# EAGLE design v4.01 (EAGLE 6.2)
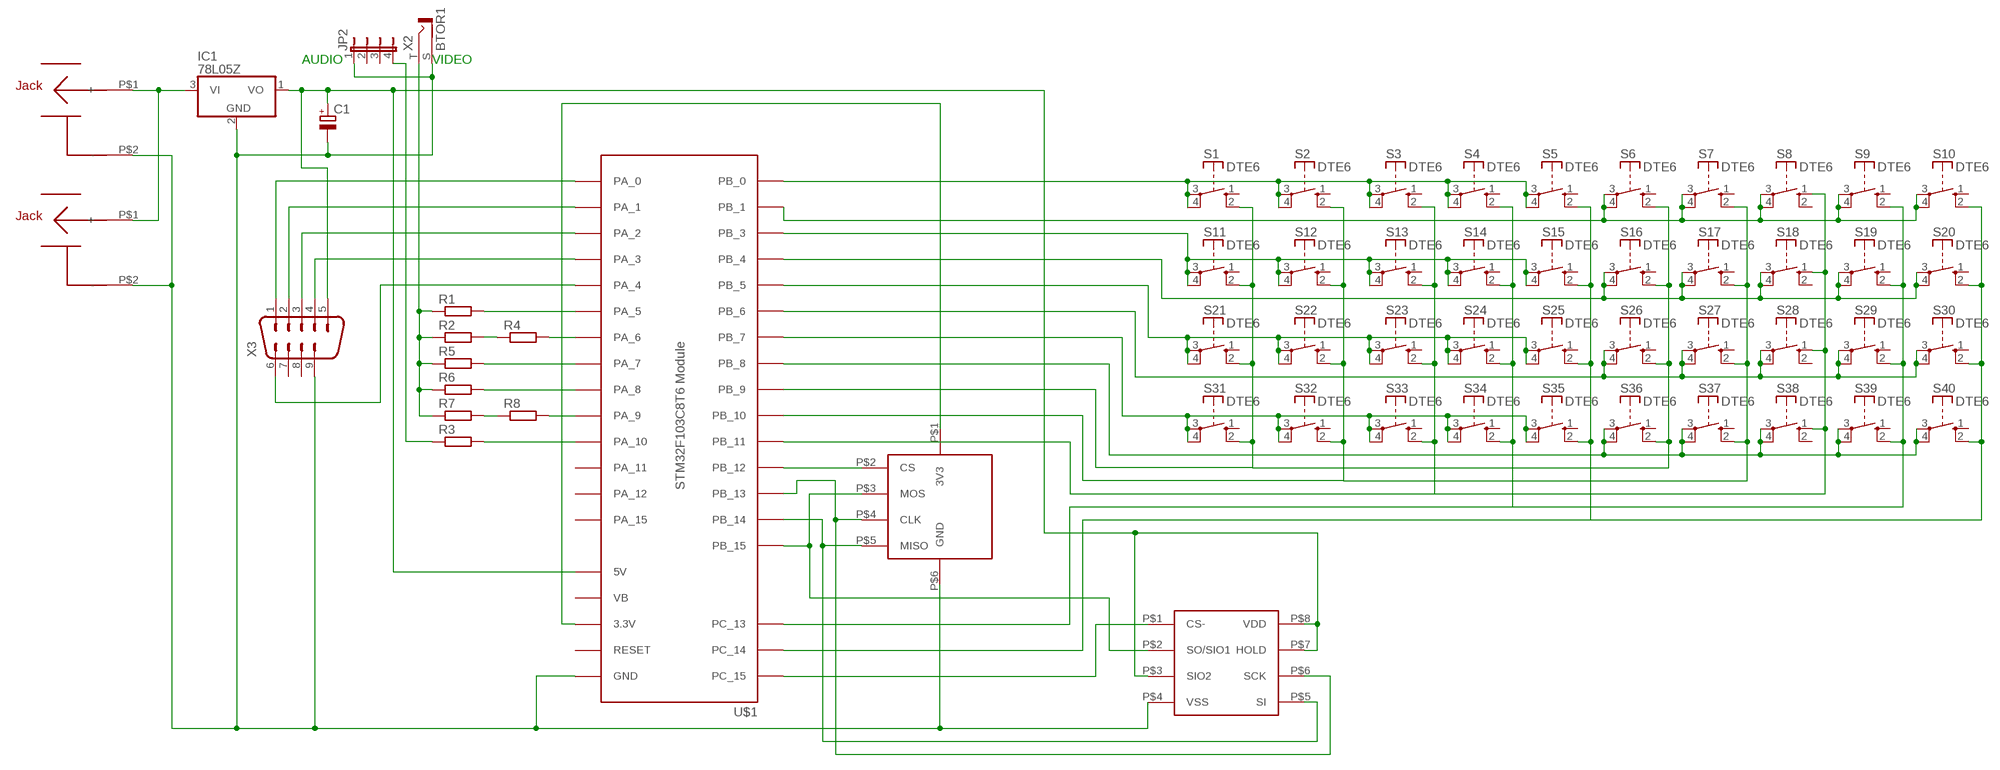
[diagram p0: schematic, sheet 1]

## Parts
C1  CPOL-EUE3.5-8  [E3,5-8]
IC1  78L05Z  [TO92]
JP2  JP4E  [JP4]
R1  R-EU_0204/2V  [0204V]
R2  R-EU_0204/2V  [0204V]
R3  R-EU_0204/2V  [0204V]
R4  R-EU_0204/2V  [0204V]
R5  R-EU_0204/2V  [0204V]
R6  R-EU_0204/2V  [0204V]
R7  R-EU_0204/2V  [0204V]
R8  R-EU_0204/2V  [0204V]
S1  DTE6  [DTE6]
S2  DTE6  [DTE6]
S3  DTE6  [DTE6]
S4  DTE6  [DTE6]
S5  DTE6  [DTE6]
S6  DTE6  [DTE6]
S7  DTE6  [DTE6]
S8  DTE6  [DTE6]
S9  DTE6  [DTE6]
S10  DTE6  [DTE6]
S11  DTE6  [DTE6]
S12  DTE6  [DTE6]
S13  DTE6  [DTE6]
S14  DTE6  [DTE6]
S15  DTE6  [DTE6]
S16  DTE6  [DTE6]
S17  DTE6  [DTE6]
S18  DTE6  [DTE6]
S19  DTE6  [DTE6]
S20  DTE6  [DTE6]
S21  DTE6  [DTE6]
S22  DTE6  [DTE6]
S23  DTE6  [DTE6]
S24  DTE6  [DTE6]
S25  DTE6  [DTE6]
S26  DTE6  [DTE6]
S27  DTE6  [DTE6]
S28  DTE6  [DTE6]
S29  DTE6  [DTE6]
S30  DTE6  [DTE6]
S31  DTE6  [DTE6]
S32  DTE6  [DTE6]
S33  DTE6  [DTE6]
S34  DTE6  [DTE6]
S35  DTE6  [DTE6]
S36  DTE6  [DTE6]
S37  DTE6  [DTE6]
S38  DTE6  [DTE6]
S39  DTE6  [DTE6]
S40  DTE6  [DTE6]
U$1  STM32F103C8T6-MODULE  [STM32F103C8T6-MODULE]
U$2  SD-READER  [SD_READER]
U$3  23LC1024  [4DIP]
U$4  JACK-PLUG  [JACK-PLUG]
U$5  JACK-PLUG  [JACK-PLUG]
X2  BTOR1  [BTOR1]
X3  M09D  [M09D]

## Nets
N$1: C1.+ IC1.1(VO) U$1.5V U$3.P$3(SIO2) U$3.P$7(HOLD) U$3.P$8(VDD) X3.5
N$2: U$1.PA_0 X3.1
N$3: U$1.PA_1 X3.2
N$4: U$1.PA_2 X3.3
N$5: U$1.PA_3 X3.4
N$6: U$1.PA_4 X3.6
N$7: R1.1 R2.1 R5.1 R6.1 R7.1 X2.T
N$8: R1.2 U$1.PA_5
N$9: R2.2 R4.1
N$10: JP2.4 R3.1
N$11: R4.2 U$1.PA_6
N$12: U$1.3.3V@1(3.3V) U$1.3.3V@2(3.3V) U$2.P$1(3V3)
N$13: C1.- IC1.2(GND) JP2.1 U$1.GND@1(GND) U$1.GND@2(GND) U$1.GND@3(GND) U$2.P$6(GND) U$3.P$4(VSS) U$4.P$2(-) U$5.P$2(-) X2.S X3.9
N$14: U$1.PB_15 U$2.P$3(MOS) U$3.P$2(SO/SIO1)
N$15: U$1.PB_14 U$2.P$5(MISO) U$3.P$5(SI)
N$16: U$1.PB_13 U$2.P$4(CLK) U$3.P$6(SCK)
N$17: U$1.PB_12 U$2.P$2(CS)
N$18: S1.3(P) S1.4(P) S2.3(P) S2.4(P) S3.3(P) S3.4(P) S4.3(P) S4.4(P) S5.3(P) S5.4(P) U$1.PB_0
N$19: S6.3(P) S6.4(P) S7.3(P) S7.4(P) S8.3(P) S8.4(P) S9.3(P) S9.4(P) S10.3(P) S10.4(P) U$1.PB_1
N$20: S11.3(P) S11.4(P) S12.3(P) S12.4(P) S13.3(P) S13.4(P) S14.3(P) S14.4(P) S15.3(P) S15.4(P) U$1.PB_3
N$21: S16.3(P) S16.4(P) S17.3(P) S17.4(P) S18.3(P) S18.4(P) S19.3(P) S19.4(P) S20.3(P) S20.4(P) U$1.PB_4
N$22: S21.3(P) S21.4(P) S22.3(P) S22.4(P) S23.3(P) S23.4(P) S24.3(P) S24.4(P) S25.3(P) S25.4(P) U$1.PB_5
N$23: S26.3(P) S26.4(P) S27.3(P) S27.4(P) S28.3(P) S28.4(P) S29.3(P) S29.4(P) S30.3(P) S30.4(P) U$1.PB_6
N$24: S31.3(P) S31.4(P) S32.3(P) S32.4(P) S33.3(P) S33.4(P) S34.3(P) S34.4(P) S35.3(P) S35.4(P) U$1.PB_7
N$25: S36.3(P) S36.4(P) S37.3(P) S37.4(P) S38.3(P) S38.4(P) S39.3(P) S39.4(P) S40.3(P) S40.4(P) U$1.PB_8
N$26: S1.2(S) S6.2(S) S11.2(S) S16.2(S) S21.2(S) S26.2(S) S31.2(S) S36.2(S) U$1.PB_9
N$27: S2.2(S) S7.2(S) S12.2(S) S17.2(S) S22.2(S) S27.2(S) S32.2(S) S37.2(S) U$1.PB_10
N$28: S3.2(S) S8.1(S) S13.2(S) S18.1(S) S23.2(S) S28.1(S) S33.2(S) S38.1(S) U$1.PB_11
N$29: S4.2(S) S9.2(S) S14.2(S) S19.2(S) S24.2(S) S29.2(S) S34.2(S) S39.2(S) U$1.PC_13
N$30: S5.2(S) S10.2(S) S15.2(S) S20.2(S) S25.2(S) S30.2(S) S35.2(S) S40.2(S) U$1.PC_14
N$31: U$1.PC_15 U$3.P$1(CS-)
N$32: IC1.3(VI) U$4.P$1(+) U$5.P$1(+)
N$33: R7.2 R8.1
N$34: R8.2 U$1.PA_9
N$35: R6.2 U$1.PA_8
N$36: R5.2 U$1.PA_7
N$37: R3.2 U$1.PA_10
Unconnected: JP2.2 JP2.3 S1.1(S) S2.1(S) S3.1(S) S4.1(S) S5.1(S) S6.1(S) S7.1(S) S8.2(S) S9.1(S) S10.1(S) S11.1(S) S12.1(S) S13.1(S) S14.1(S) S15.1(S) S16.1(S) S17.1(S) S18.2(S) S19.1(S) S20.1(S) S21.1(S) S22.1(S) S23.1(S) S24.1(S) S25.1(S) S26.1(S) S27.1(S) S28.2(S) S29.1(S) S30.1(S) S31.1(S) S32.1(S) S33.1(S) S34.1(S) S35.1(S) S36.1(S) S37.1(S) S38.2(S) S39.1(S) S40.1(S) U$1.PA_11 U$1.PA_12 U$1.PA_15 U$1.RESET U$1.VB X2.S@1 X2.S@2 X2.S@3 X3.7 X3.8

## Notes on the sheet
- AUDIO | VIDEO

## Library data of the parts
C1 = rcl:CPOL-EU: POLARIZED CAPACITOR, European symbol
IC1 = linear:78*: Positive VOLTAGE REGULATOR Source: http://cache.national.com/ds/LM/LM78L05.pdf http://www.fairchildsemi.com/ds/LM/LM7805.pdf
JP2 = jumper:JP4E: JUMPER
R1-R8 = rcl:R-EU_: RESISTOR, European symbol
S1-S40 = switch-misc:DT: ITT SWITCH
U$1 = bluepill_eagle:STM32F103C8T6-MODULE: STM32F103C8T6 module with ARM Cortex-3, 20kB SRAM, 64kB Flash, 72MHz
U$2 = _ArduinoNano:SD-READER
U$3 = _ArduinoNano:23LC1024
U$4 U$5 = _ArduinoNano:JACK-PLUG
X2 = con-lumberg:BTOR1: RCA connectors according to JEITA RC-5231 Cinch RCA-Einbaukupplung nach JEITA RC-5231, stehende Ausführung Source: http://www.lumberg.de/Produkte/PDFs/BTOR1.pdf; MPN: BTOR 1; OC_FARNELL: 1217030; OC_NEWARK: 96K7172
X3 = con-subd:M09: SUB-D

## Board
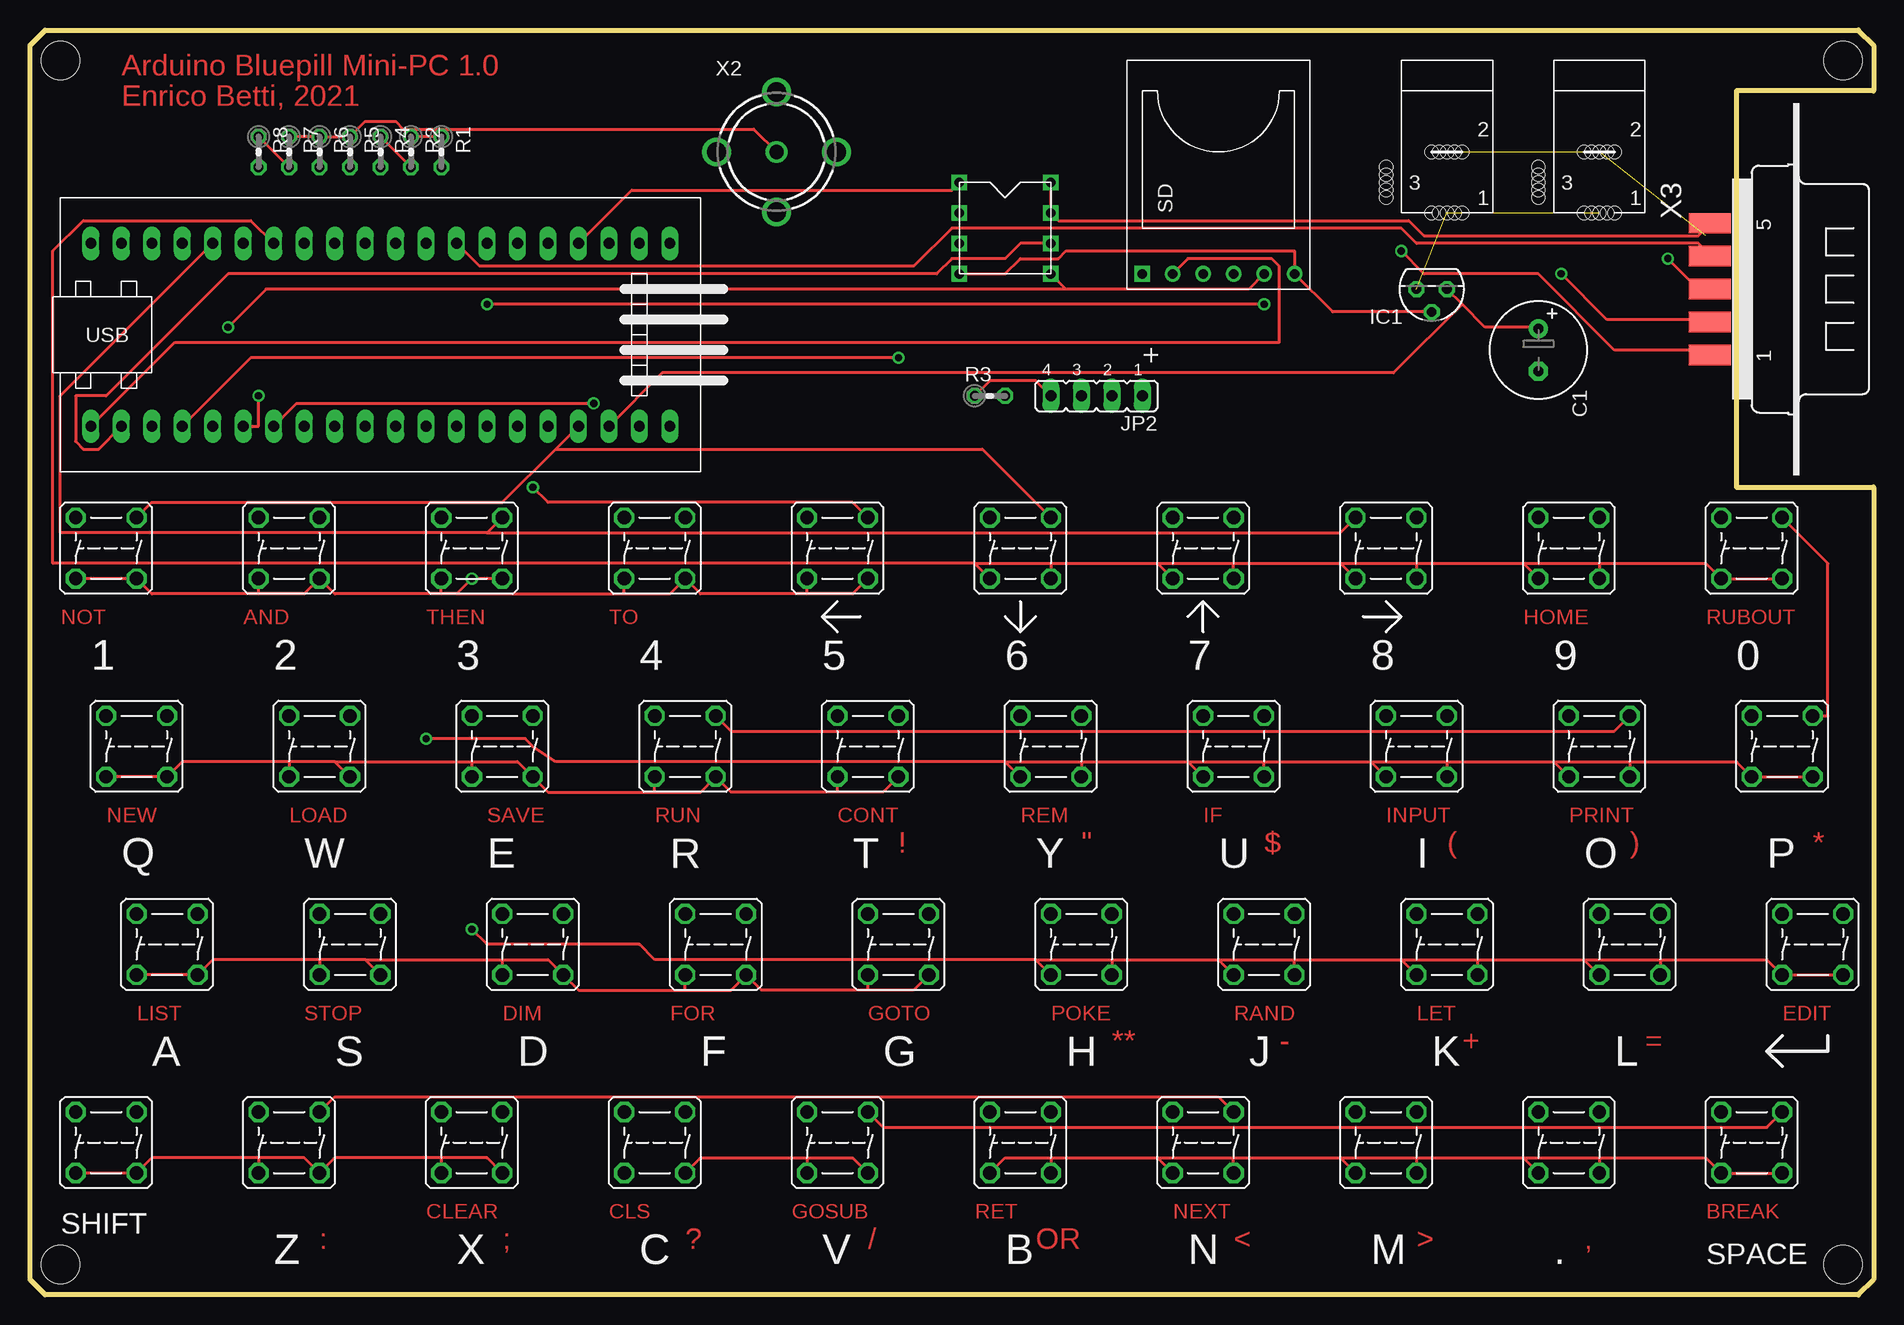
[diagram p1: board, top side]
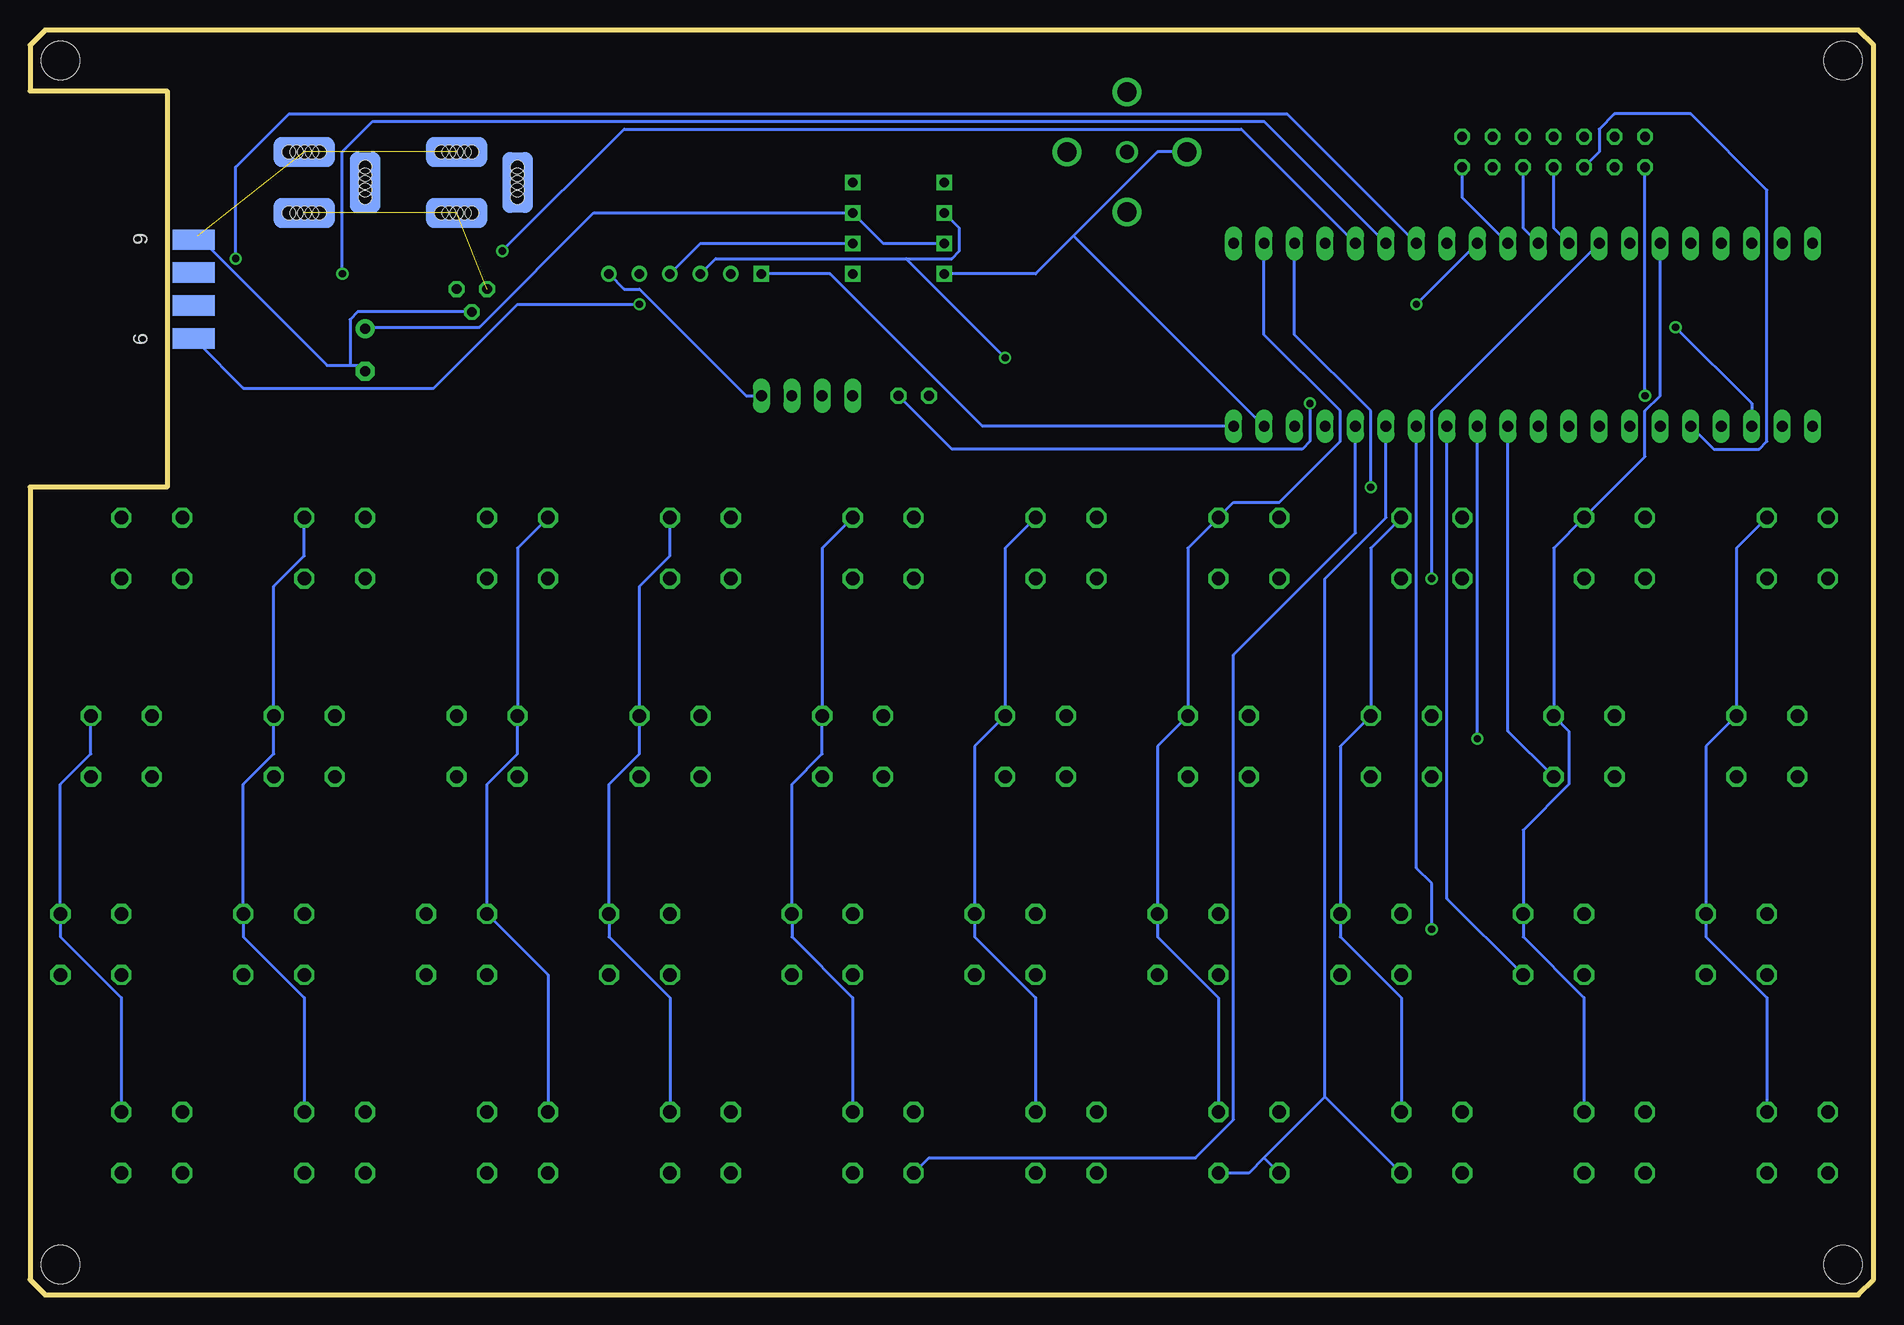
[diagram p2: board, bottom side, seen from below]

Size 153.67 x 105.41 mm. Coordinates in mm from the lower left corner, seen from the top.
Outline: 0,1.27 0,104.14 1.27,105.41 152.4,105.41 153.67,104.14 153.67,100.33 142.24,100.33 142.24,67.31 153.67,67.31 153.67,1.27 152.4,0 1.27,0 0,1.27
Copper layers (1*16): Top 0.035mm / dielectric 1.5mm / Bottom 0.035mm
Design rules: minimum track width 10mil, minimum drill 24mil, track to track 8mil, track to pad 8mil, pad to pad 8mil, via to via 8mil, smd to smd 8mil, copper to edge 40mil, drill to drill 8mil, minimum pad ring 10mil, minimum via ring 8mil, stop-mask expansion 4mil, vias tented up to drill 0mil, thermal gap 10mil
Holes 3.2 mm at 2.54,102.87 151.13,102.87 151.13,2.54 2.54,2.54

### Footprints (pad centres in the part's own frame; a part is rotated, then mirrored left to right if it is on the bottom)
E3,5-8 = drill 0.813 pad 1.6: + -1.778,0 | drill 0.813 pad 1.6 octagon: - 1.778,0
TO92 = drill 0.813 octagon: 1 -1.27,0; 2 0,1.905; 3 1.27,0
JP4 = drill 0.914 long: 1 -3.81,0; 2 -1.27,0; 3 1.27,0; 4 3.81,0
0204V = drill 0.813 octagon: 1 -1.27,0; 2 1.27,0
DTE6 = drill 1.118 octagon: 1 -2.54,2.54; 2 2.54,2.54; 3 2.54,-2.54; 4 -2.54,-2.54
STM32F103C8T6-MODULE = drill 0.9 long: 3.3V@1 25.4,-7.62; 3.3V@2 -17.78,7.62; 5V 20.32,-7.62; GND@1 22.86,-7.62; GND@2 -20.32,7.62; GND@3 -22.86,7.62; PA_0 15.24,7.62; PA_1 12.7,7.62; PA_2 10.16,7.62; PA_3 7.62,7.62; PA_4 5.08,7.62; PA_5 2.54,7.62; PA_6 0,7.62; PA_7 -2.54,7.62; PA_8 -12.7,-7.62; PA_9 -10.16,-7.62; PA_10 -7.62,-7.62; PA_11 -5.08,-7.62; PA_12 -2.54,-7.62; PA_15 0,-7.62; PB_0 -5.08,7.62; PB_1 -7.62,7.62; PB_3 2.54,-7.62; PB_4 5.08,-7.62; PB_5 7.62,-7.62; PB_6 10.16,-7.62; PB_7 12.7,-7.62; PB_8 15.24,-7.62; PB_9 17.78,-7.62; PB_10 -10.16,7.62; PB_11 -12.7,7.62; PB_12 -22.86,-7.62; PB_13 -20.32,-7.62; PB_14 -17.78,-7.62; PB_15 -15.24,-7.62; PC_13 22.86,7.62; PC_14 20.32,7.62; PC_15 17.78,7.62; RESET -15.24,7.62; VB 25.4,7.62
SD_READER = drill 0.8 square: P$1 -3.81,7.62 | drill 0.8: P$2 -3.81,5.08; P$3 -3.81,2.54; P$4 -3.81,0; P$5 -3.81,-2.54; P$6 -3.81,-5.08
4DIP = drill 0.8 square: P$1 -3.81,3.81; P$2 -3.81,1.27; P$3 -3.81,-1.27; P$4 -3.81,-3.81; P$5 3.81,-3.81; P$6 3.81,-1.27; P$7 3.81,1.27; P$8 3.81,3.81
JACK-PLUG = smd 5.08 x 2.54 bottom: P$1 0,-5.08; P$2 0,0 | smd 2.54 x 5.08 bottom: P$3 -5.08,-2.54 | hole 1.1: -5.08,-1.27; -5.08,-3.81; -1.27,0; 1.27,0; -1.27,-5.08; 1.27,-5.08; -5.08,-1.905; -5.08,-3.175; -0.635,0; 0.635,0; -0.635,-5.08; 0.635,-5.08; -5.08,-2.54; 0,0; 0,-5.08
BTOR1 = drill 1.6 pad 2.2: S -5,0; S@1 0,5; S@2 5,0; S@3 0,-5 | drill 1.2 pad 1.6: T 0,0
M09D = smd 1.7 x 3.5: 1 5.486,-6.045; 2 2.743,-6.045; 3 0,-6.045; 4 -2.743,-6.045; 5 -5.486,-6.045 | smd 1.7 x 3.5 bottom: 6 4.115,-6.045; 7 1.372,-6.045; 8 -1.372,-6.045; 9 -4.115,-6.045

### Placement (x,y rotation side)
C1  125.73,78.74 270 top
IC1  116.84,83.82 180 top
JP2  88.9,74.93 180 top
R1  34.29,95.25 270 top
R2  31.75,95.25 270 top
R3  80.01,74.93 0 top
R4  29.21,95.25 270 top
R5  26.67,95.25 270 top
R6  24.13,95.25 270 top
R7  21.59,95.25 270 top
R8  19.05,95.25 270 top
S1  6.35,62.23 0 top
S2  21.59,62.23 0 top
S3  36.83,62.23 0 top
S4  52.07,62.23 0 top
S5  67.31,62.23 0 top
S6  82.55,62.23 0 top
S7  97.79,62.23 0 top
S8  113.03,62.23 0 top
S9  128.27,62.23 0 top
S10  143.51,62.23 0 top
S11  8.89,45.72 0 top
S12  24.13,45.72 0 top
S13  39.37,45.72 0 top
S14  54.61,45.72 0 top
S15  69.85,45.72 0 top
S16  85.09,45.72 0 top
S17  100.33,45.72 0 top
S18  115.57,45.72 0 top
S19  130.81,45.72 0 top
S20  146.05,45.72 0 top
S21  11.43,29.21 0 top
S22  26.67,29.21 0 top
S23  41.91,29.21 0 top
S24  57.15,29.21 0 top
S25  72.39,29.21 0 top
S26  87.63,29.21 0 top
S27  102.87,29.21 0 top
S28  118.11,29.21 0 top
S29  133.35,29.21 0 top
S30  148.59,29.21 0 top
S31  6.35,12.7 0 top
S32  21.59,12.7 0 top
S33  36.83,12.7 0 top
S34  52.07,12.7 0 top
S35  67.31,12.7 0 top
S36  82.55,12.7 0 top
S37  97.79,12.7 0 top
S38  113.03,12.7 0 top
S39  128.27,12.7 0 top
S40  143.51,12.7 0 top
U$1  27.94,80.01 0 top
U$2  100.33,88.9 90 top
U$3  81.28,88.9 0 top
U$4  118.11,95.25 0 top
U$5  130.81,95.25 0 top
X2  62.23,95.25 0 top
X3  146.05,83.82 270 top

### Tracks (layer width: path | path; a pad name or v marks a point on that pad's centre or on a via)
N$1
  Top 0.254: U$3.P$8 U$3.P$7 85.73,89.53 114.94,89.53 116.21,88.27 139.06,88.27 139.7,88.9 X3.5 | 119.38,82.55 121.29,80.64 125.73,80.64 C1.+ | 119.38,82.55 IC1.1 | U$1.5V 52.7,76.84 113.67,76.84 119.38,82.55
  Bottom 0.254: U$3.P$3 82.55,87.63 U$3.P$7 106.68,90.17 116.21,80.64 125.73,80.64 C1.+
N$2  (via drill 0.61)
  Top 0.254: v114.3,87 116.21,85.09 125.73,85.09 132.08,78.74 139.7,78.74 X3.1
  Bottom 0.254: U$1.PA_0 52.7,97.16 104.14,97.16 v114.3,87
N$3  (via drill 0.61)
  Top 0.254: v127.64,85.09 131.44,81.28 139.7,81.28 X3.2
  Bottom 0.254: U$1.PA_1 50.8,97.79 125.09,97.79 127.64,95.25 v127.64,85.09
N$4  (via drill 0.61)
  Top 0.254: v136.53,86.36 139.06,83.82 X3.3
  Bottom 0.254: U$1.PA_2 48.89,98.42 132.08,98.42 136.53,93.98 v136.53,86.36
N$5
  Top 0.254: U$1.PA_3 37.46,85.73 73.66,85.73 76.84,88.9 114.3,88.9 115.57,87.63 139.06,87.63 139.7,87 X3.4
N$6  (via drill 0.61)
  Top 0.254: v102.87,82.55 v38.1,82.55
  Bottom 0.254: v38.1,82.55 U$1.PA_4 | v102.87,82.55 113.03,82.55 120.02,75.56 135.89,75.56 139.7,79.38 X3.6
N$7
  Top 0.254: R1.1 R2.1 31.12,97.16 | R7.1 R6.1 R5.1 27.94,97.79 30.48,97.79 31.12,97.16 | X2.T 60.32,97.16 31.12,97.16
N$8
  Bottom 0.254: R1.2 34.29,91.44 U$1.PA_5
N$9
  Top 0.254: R2.2 R4.1
N$10
  Top 0.254: R3.1 80.01,76.2 83.82,76.2 JP2.4
N$11
  Bottom 0.254: R4.2 29.21,88.9 U$1.PA_6
N$12
  Bottom 0.254: U$2.P$1 87,85.09 74.3,72.39 U$1.3.3V@1
N$13  (2 unrouted)
  Top 0.254: IC1.2 108.59,81.92 U$2.P$6 105.41,87 86.36,87 85.73,86.36 82.55,86.36 81.28,85.09 U$3.P$4
  Bottom 0.254: U$3.P$4 69.85,85.09 66.68,88.27 | 66.68,88.27 59.69,95.25 X2.S | U$1.GND@1 66.68,88.27 | 127,77.47 128.91,77.47 139.7,88.27 X3.9 | 127,77.47 125.73,77.47 C1.- | 127,77.47 127,81.28 126.37,81.92 IC1.2 | JP2.1 93.98,74.93 102.87,83.82 104.14,83.82 U$2.P$6
N$14  (via drill 0.61)
  Top 0.254: U$1.PB_15 18.41,78.11 v72.39,78.11
  Bottom 0.254: U$3.P$2 76.2,88.9 76.2,87 76.84,86.36 80.65,86.36 | 80.65,86.36 96.52,86.36 U$2.P$3 | 80.65,86.36 v72.39,78.11
N$15  (via drill 0.61)
  Top 0.254: 86.36,83.82 U$3.P$5 | 86.36,83.82 101.6,83.82 U$2.P$5 | v16.51,80.64 19.69,83.82 86.36,83.82
  Bottom 0.254: U$1.PB_14 10.16,74.3 v16.51,80.64
N$16
  Top 0.254: U$1.PB_13 5.71,70.48 4.45,70.48 3.81,71.12 3.81,74.93 6.35,74.93 16.51,85.09 75.57,85.09 76.84,86.36 81.28,86.36 82.55,87.63 U$3.P$6
  Bottom 0.254: U$3.P$6 97.79,87.63 U$2.P$4
N$17
  Top 0.254: U$2.P$2 96.52,86.36 103.51,86.36 104.14,85.73 104.14,79.38 12.06,79.38 U$1.PB_12
N$18  (via drill 0.61)
  Top 0.254: 64.77,58.42 68.58,58.42 S5.3 | 64.77,58.42 55.88,58.42 S4.3 53.34,58.42 49.53,58.42 | 19.05,58.42 22.86,58.42 S2.3 25.4,58.42 34.29,58.42 | 19.05,58.42 10.16,58.42 S1.3 S1.4 | S3.3 v36.83,59.69 35.56,58.42 | 35.56,58.42 34.29,58.42 | 35.56,58.42 49.53,58.42 | 19.05,58.42 S2.4 | 34.29,58.42 S3.4 | 49.53,58.42 S4.4 | 64.77,58.42 S5.4
  Bottom 0.254: U$1.PB_0 36.83,73.66 v36.83,59.69
N$19
  Top 0.254: U$1.PB_1 18.41,89.53 4.45,89.53 1.91,87 1.91,60.96 78.74,60.96 | S6.4 78.74,60.96 | 93.98,60.96 S7.4 | 78.74,60.96 85.09,60.96 | 85.09,60.96 93.98,60.96 | 109.22,60.96 S8.4 | 93.98,60.96 100.33,60.96 | 100.33,60.96 109.22,60.96 | 124.46,60.96 S9.4 | 109.22,60.96 115.57,60.96 | 115.57,60.96 124.46,60.96 | 124.46,60.96 130.81,60.96 | 130.81,60.96 139.7,60.96 S10.4 S10.3 | 85.09,60.96 S6.3 | S7.3 100.33,60.96 | 115.57,60.96 S8.3 | 130.81,60.96 S9.3
N$20
  Top 0.254: 67.31,41.91 71.12,41.91 S15.3 | 67.31,41.91 58.42,41.91 S14.3 55.88,41.91 52.07,41.91 | 25.4,44.45 21.59,44.45 | 21.59,44.45 12.7,44.45 S11.3 S11.4 | S12.3 25.4,44.45 | 25.4,44.45 36.83,44.45 | 36.83,44.45 40.64,44.45 S13.3 43.18,41.91 52.07,41.91 | 21.59,44.45 S12.4 | 36.83,44.45 S13.4 | 52.07,41.91 S14.4 | 67.31,41.91 S15.4
  Bottom 0.254: U$1.PB_3 30.48,46.99 S12.3
N$21  (via drill 0.61)
  Top 0.254: v33.02,46.36 41.27,46.36 41.91,45.72 43.81,44.45 81.28,44.45 | S16.4 81.28,44.45 | 96.52,44.45 S17.4 | 81.28,44.45 87.63,44.45 | 87.63,44.45 96.52,44.45 | 111.76,44.45 S18.4 | 96.52,44.45 102.87,44.45 | 102.87,44.45 111.76,44.45 | 127,44.45 S19.4 | 111.76,44.45 118.11,44.45 | 118.11,44.45 127,44.45 | 127,44.45 133.35,44.45 | 133.35,44.45 142.24,44.45 S20.4 S20.3 | 87.63,44.45 S16.3 | S17.3 102.87,44.45 | 118.11,44.45 S18.3 | 133.35,44.45 S19.3
  Bottom 0.254: v33.02,46.36 U$1.PB_4
N$22
  Top 0.254: 69.85,25.4 73.66,25.4 S25.3 | 69.85,25.4 60.96,25.4 S24.3 58.42,25.4 54.61,25.4 | 27.94,27.94 24.13,27.94 | 24.13,27.94 15.24,27.94 S21.3 S21.4 | S22.3 27.94,27.94 | 27.94,27.94 39.37,27.94 | 39.37,27.94 43.18,27.94 S23.3 45.72,25.4 54.61,25.4 | 24.13,27.94 S22.4 | 39.37,27.94 S23.4 | 54.61,25.4 S24.4 | 69.85,25.4 S25.4
  Bottom 0.254: U$1.PB_5 35.56,33.02 S22.3
N$23  (via drill 0.61)
  Top 0.254: v36.83,30.48 38.1,29.21 50.8,29.21 52.07,27.94 83.82,27.94 | S26.4 83.82,27.94 | 99.06,27.94 S27.4 | 83.82,27.94 90.17,27.94 | 90.17,27.94 99.06,27.94 | 114.3,27.94 S28.4 | 99.06,27.94 105.41,27.94 | 105.41,27.94 114.3,27.94 | 129.54,27.94 S29.4 | 114.3,27.94 120.65,27.94 | 120.65,27.94 129.54,27.94 | 129.54,27.94 135.89,27.94 | 135.89,27.94 144.78,27.94 S30.4 S30.3 | 90.17,27.94 S26.3 | S27.3 105.41,27.94 | 120.65,27.94 S28.3 | 135.89,27.94 S29.3
  Bottom 0.254: v36.83,30.48 36.83,34.29 38.1,35.56 U$1.PB_6
N$24
  Top 0.254: 19.05,11.43 22.86,11.43 S32.3 25.4,11.43 34.29,11.43 | 19.05,11.43 10.16,11.43 S31.3 S31.4 | S35.3 68.58,11.43 64.77,11.43 | 64.77,11.43 55.88,11.43 S34.3 | 34.29,11.43 38.1,11.43 S33.3 | 19.05,11.43 S32.4 | 34.29,11.43 S33.4 | 64.77,11.43 S35.4
  Bottom 0.254: U$1.PB_7 40.64,64.77 45.72,59.69 45.72,16.51 | S33.3 45.72,16.51 | S34.3 52.07,10.16 50.8,11.43 | 45.72,16.51 50.8,11.43 | 50.8,11.43 S34.4
N$25
  Top 0.254: 93.98,11.43 S37.4 | 85.09,11.43 81.28,11.43 S36.4 | 85.09,11.43 93.98,11.43 | 109.22,11.43 S38.4 | 93.98,11.43 100.33,11.43 | 100.33,11.43 109.22,11.43 | 124.46,11.43 S39.4 | 109.22,11.43 115.57,11.43 | 115.57,11.43 124.46,11.43 | 124.46,11.43 130.81,11.43 | 130.81,11.43 139.7,11.43 S40.4 S40.3 | 85.09,11.43 S36.3 | S37.3 100.33,11.43 | 115.57,11.43 S38.3 | 130.81,11.43 S39.3
  Bottom 0.254: U$1.PB_8 43.18,63.5 53.34,53.34 53.34,14.6 56.52,11.43 78.74,11.43 S36.4
N$26
  Top 0.254: 43.81,70.48 39.37,66.04 10.16,66.04 S1.2 | 43.81,70.48 U$1.PB_9 | S6.2 79.38,70.48 43.81,70.48
  Bottom 0.254: S6.2 87.63,62.23 S16.2 87.63,45.08 90.17,42.55 S26.2 90.17,29.84 85.09,24.77 S36.2 | S31.2 8.89,24.77 13.97,29.84 S21.2 13.97,45.72 S11.2 11.43,62.23 S1.2
N$27
  Top 0.254: S37.2 99.06,16.51 25.4,16.51 S32.2
  Bottom 0.254: S7.2 100.33,61.59 102.87,59.05 S17.2 102.87,45.08 105.41,42.55 S27.2 105.41,29.84 100.33,24.77 S37.2 | S32.2 24.13,24.77 29.21,29.84 S22.2 29.21,38.73 25.4,42.55 25.4,46.99 S12.2 26.67,62.23 S2.2 19.05,69.85 19.05,73.66 17.78,74.93 U$1.PB_10
N$28
  Top 0.254: U$1.PB_11 2.54,74.93 2.54,63.5 38.1,63.5 | S3.2 38.1,63.5 | S8.1 109.22,63.5 38.1,63.5
  Bottom 0.254: S8.1 113.03,62.23 S18.1 113.03,45.08 115.57,42.55 S28.1 110.49,26.67 S38.1 | S33.2 39.37,24.77 44.45,29.84 S23.2 44.45,45.72 S13.2 41.91,62.23 S3.2
N$29
  Top 0.254: S19.2 132.08,46.99 58.42,46.99 S14.2
  Bottom 0.254: S9.2 130.81,61.59 133.35,59.05 S19.2 133.35,45.08 135.89,42.55 S29.2 135.89,29.84 130.81,24.77 S39.2 | S34.2 54.61,24.77 59.69,29.84 S24.2 59.69,45.72 S14.2 57.15,62.23 S4.2 53.34,66.04 49.53,66.04 44.45,71.12 44.45,73.66 50.8,80.01 U$1.PC_13
N$30  (via drill 0.61)
  Top 0.254: v41.91,67.31 43.18,66.04 68.58,66.04 S5.2 | S10.2 149.86,60.96 149.86,48.26 S20.2 | S40.2 144.78,13.97 71.12,13.97 S35.2
  Bottom 0.254: S40.2 146.05,24.77 151.13,29.84 S30.2 151.13,42.55 148.59,45.08 S20.2 | S35.2 69.85,24.77 74.93,29.84 S25.2 74.93,45.72 S15.2 72.39,62.23 S5.2 | U$1.PC_14 48.26,80.01 41.91,73.66 v41.91,67.31
N$31
  Top 0.254: U$3.P$1 76.84,92.08 50.16,92.08 U$1.PC_15
N$32  (2 unrouted)
N$33
  Top 0.254: R7.2 R8.1
N$34  (via drill 0.61)
  Top 0.254: v19.05,74.93 19.05,72.39 U$1.PA_9
  Bottom 0.254: v19.05,74.93 R8.2
N$35
  Bottom 0.254: R6.2 22.86,95.25 22.86,97.16 21.59,98.42 15.24,98.42 8.89,92.08 8.89,71.12 9.53,70.48 13.33,70.48 U$1.PA_8
N$36
  Bottom 0.254: R5.2 26.67,88.9 U$1.PA_7
N$37  (via drill 0.61)
  Top 0.254: v46.99,74.3 22.23,74.3 U$1.PA_10
  Bottom 0.254: R3.2 76.84,70.48 47.62,70.48 46.99,71.12 v46.99,74.3

### Text on the board
Top: Arduino Bluepill Mini-PC 1.0 | Enrico Betti, 2021 | NOT | AND | THEN | TO | HOME | RUBOUT | NEW | LOAD | SAVE | RUN | CONT | REM | IF | INPUT | PRINT | ! | " | $ | ( | ) | * | LIST | STOP | DIM | FOR | GOTO | POKE | RAND | LET | EDIT | ** | - | + | = | CLEAR | CLS | GOSUB | RET | NEXT | BREAK | : | ; | ? | / | OR | < | > | ,
tPlace: + | 1 | 2 | 3 | 4 | 5 | 6 | 7 | 8 | 9 | 0 | Q | W | E | R | T | Y | U | I | O | P | A | S | D | F | G | H | J | K | L | SHIFT | Z | X | C | V | B | N | M | . | SPACE